# EAGLE schematic Project1Final (EAGLE 9.3.0)
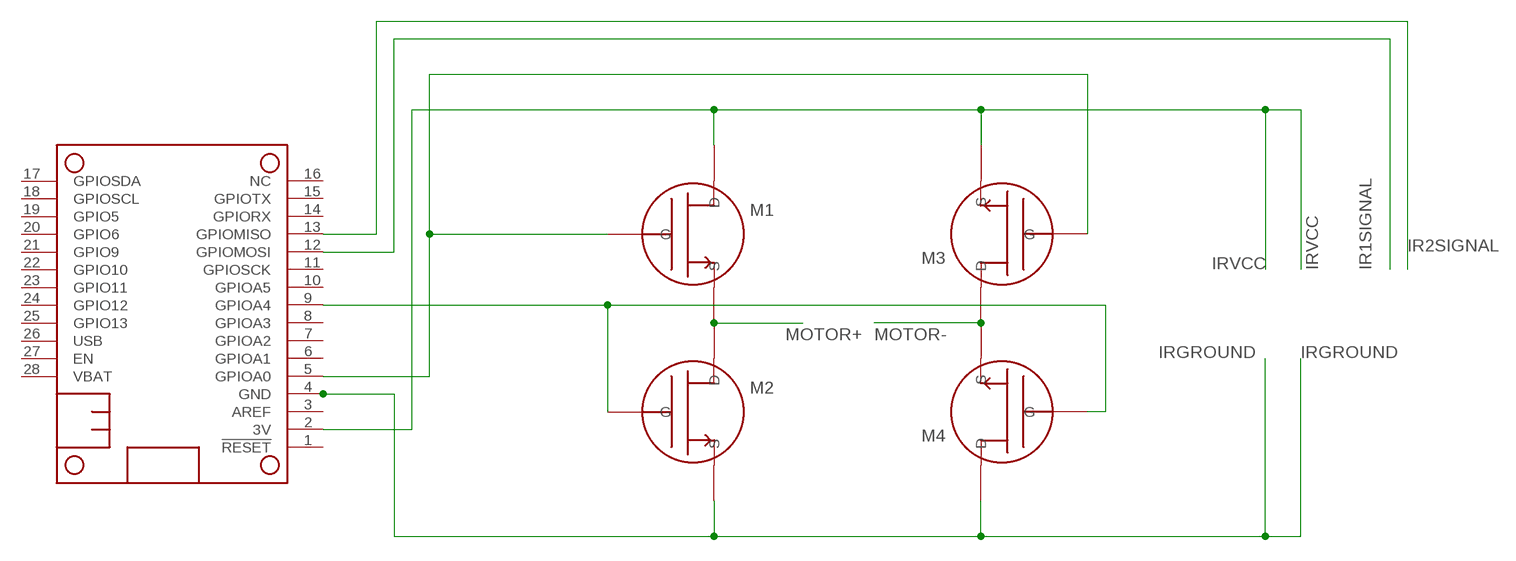
[diagram p0: schematic, sheet 1]

## Parts
M1  FET_N  (no package)
M2  FET_N  (no package)
M3  FET_N  (no package)
M4  FET_N  (no package)
MS1  FEATHERWING  [FEATHERWING]

## Nets
IR1SIGNAL: MS1.12(GPIOMOSI)
IR2SIGNAL: MS1.13(GPIOMISO)
IRGROUND: M2.S M4.D MS1.4(GND)
IRVCC: M1.D M3.S MS1.2(3V)
MOTOR+: M1.S M2.D
MOTOR-: M3.D M4.S
N$1: M1.G M3.G MS1.5(GPIOA0)
N$2: M2.G M4.G MS1.9(GPIOA4)
Unconnected: MS1.1(!RESET) MS1.3(AREF) MS1.6(GPIOA1) MS1.7(GPIOA2) MS1.8(GPIOA3) MS1.10(GPIOA5) MS1.11(GPIOSCK) MS1.14(GPIORX) MS1.15(GPIOTX) MS1.16(NC) MS1.17(GPIOSDA) MS1.18(GPIOSCL) MS1.19(GPIO5) MS1.20(GPIO6) MS1.21(GPIO9) MS1.22(GPIO10) MS1.23(GPIO11) MS1.24(GPIO12) MS1.25(GPIO13) MS1.26(USB) MS1.27(EN) MS1.28(VBAT)

## Library data of the parts
M1-M4 = ngspice-simulation:FET_N: N-Type MOS Field Effect Transistor (MOSFET)
MS1 = adafruit:FEATHERWING